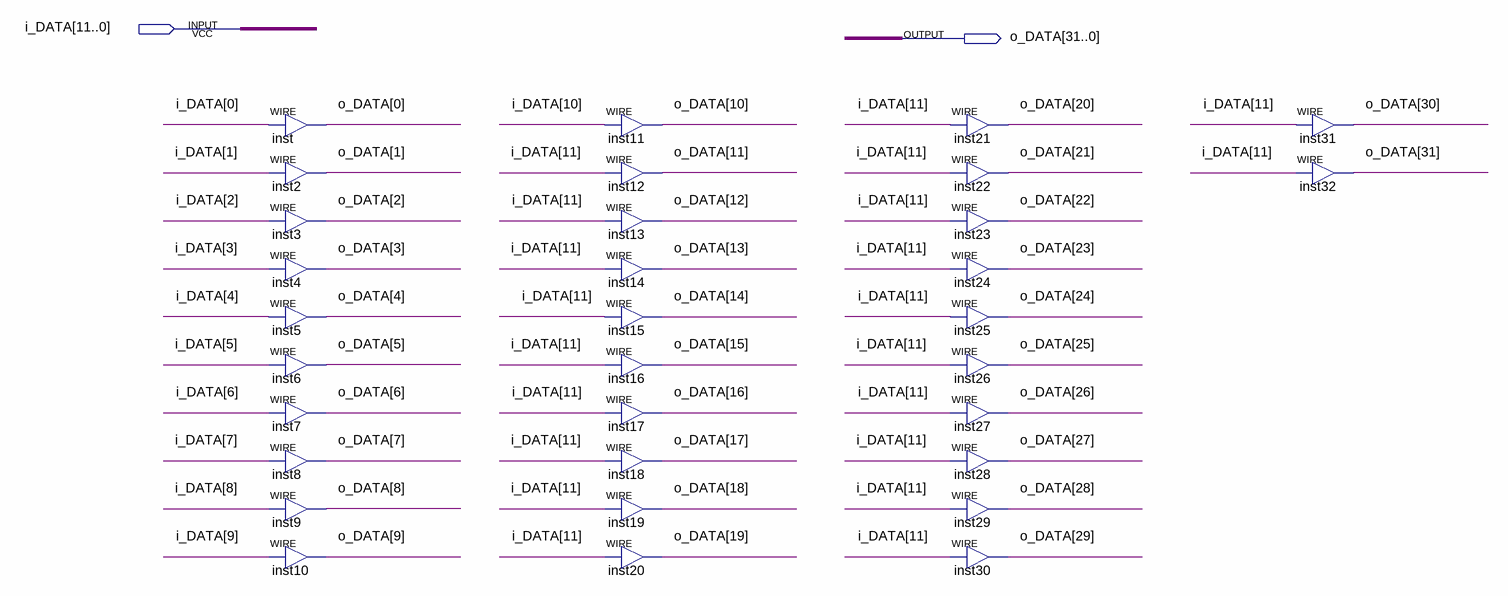
[diagram p0: schematic sheet]
// Quartus schematic signal_ext12_32.bdf as structural Verilog: 32 symbols, 2 pins
module signal_ext12_32 (
  input  [11:0] i_DATA,
  output [31:0] o_DATA
);

  assign o_DATA[0] = i_DATA[0];  // WIRE inst
  assign o_DATA[1] = i_DATA[1];  // WIRE inst2
  assign o_DATA[2] = i_DATA[2];  // WIRE inst3
  assign o_DATA[3] = i_DATA[3];  // WIRE inst4
  assign o_DATA[4] = i_DATA[4];  // WIRE inst5
  assign o_DATA[5] = i_DATA[5];  // WIRE inst6
  assign o_DATA[6] = i_DATA[6];  // WIRE inst7
  assign o_DATA[7] = i_DATA[7];  // WIRE inst8
  assign o_DATA[8] = i_DATA[8];  // WIRE inst9
  assign o_DATA[9] = i_DATA[9];  // WIRE inst10
  assign o_DATA[10] = i_DATA[10];  // WIRE inst11
  assign o_DATA[11] = i_DATA[11];  // WIRE inst12
  assign o_DATA[12] = i_DATA[11];  // WIRE inst13
  assign o_DATA[13] = i_DATA[11];  // WIRE inst14
  assign o_DATA[14] = i_DATA[11];  // WIRE inst15
  assign o_DATA[15] = i_DATA[11];  // WIRE inst16
  assign o_DATA[16] = i_DATA[11];  // WIRE inst17
  assign o_DATA[17] = i_DATA[11];  // WIRE inst18
  assign o_DATA[18] = i_DATA[11];  // WIRE inst19
  assign o_DATA[19] = i_DATA[11];  // WIRE inst20
  assign o_DATA[20] = i_DATA[11];  // WIRE inst21
  assign o_DATA[21] = i_DATA[11];  // WIRE inst22
  assign o_DATA[22] = i_DATA[11];  // WIRE inst23
  assign o_DATA[23] = i_DATA[11];  // WIRE inst24
  assign o_DATA[24] = i_DATA[11];  // WIRE inst25
  assign o_DATA[25] = i_DATA[11];  // WIRE inst26
  assign o_DATA[26] = i_DATA[11];  // WIRE inst27
  assign o_DATA[27] = i_DATA[11];  // WIRE inst28
  assign o_DATA[28] = i_DATA[11];  // WIRE inst29
  assign o_DATA[29] = i_DATA[11];  // WIRE inst30
  assign o_DATA[30] = i_DATA[11];  // WIRE inst31
  assign o_DATA[31] = i_DATA[11];  // WIRE inst32
endmodule
